# EAGLE design schemat sterownika (EAGLE 9.6.2)
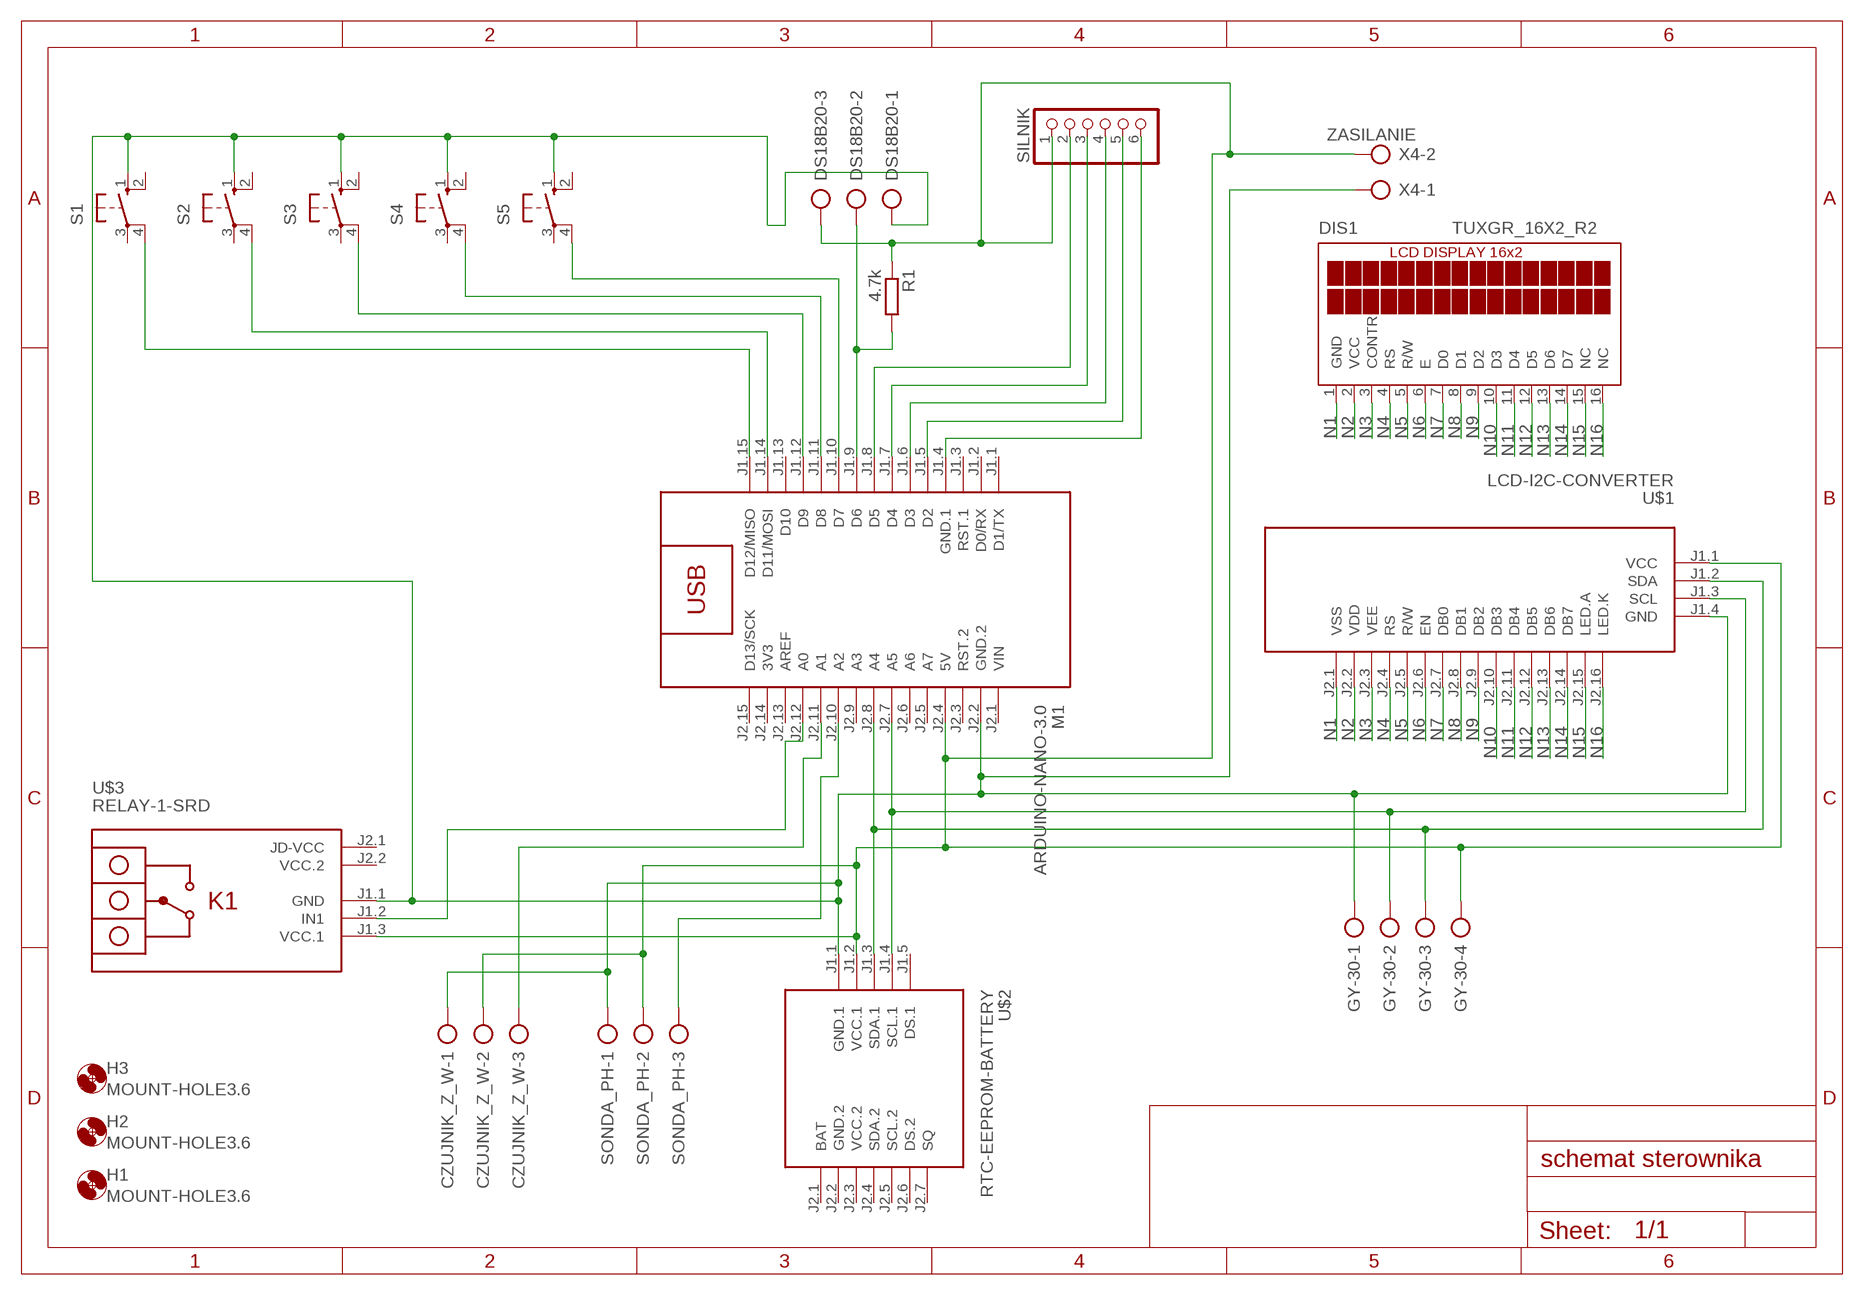
[diagram p0: schematic, sheet 1]

## Parts
CZUJNIK_Z_W  AK500/3  [AK500/3]
DIS1  TUXGR_16X2_R2  [TUXGR_16X2_R2]
DS18B20  AK500/3  [AK500/3]
GY-30  AK500/4  [AK500/4]
H1  MOUNT-HOLE3.6  [3,6]
H2  MOUNT-HOLE3.6  [3,6]
H3  MOUNT-HOLE3.6  [3,6]
M1  ARDUINO-NANO-3.0  [ARDUINO-NANO-3.0]
R1  4.7k  R-EU_0204/7  [0204/7]
S1  10-XX  [B3F-10XX]
S2  10-XX  [B3F-10XX]
S3  10-XX  [B3F-10XX]
S4  10-XX  [B3F-10XX]
S5  10-XX  [B3F-10XX]
SILNIK  PINHD-1X6  [1X06]
SONDA_PH  AK500/3  [AK500/3]
U$1  LCD-I2C-CONVERTER  [LCD-I2C-CONVERTER]
U$2  RTC-EEPROM-BATTERY  [RTC-EEPROM-BATTERY]
U$3  RELAY-1-SRD  [RELAY-1-SRD]
X4  ZASILANIE  AK500/2  [AK500/2]

## Nets
N1: DIS1.1(GND) U$1.J2.1(VSS)
N2: DIS1.2(VCC) U$1.J2.2(VDD)
N3: DIS1.3(CONTR) U$1.J2.3(VEE)
N4: DIS1.4(RS) U$1.J2.4(RS)
N5: DIS1.5(R/W) U$1.J2.5(R/W)
N6: DIS1.6(E) U$1.J2.6(EN)
N7: DIS1.7(D0) U$1.J2.7(DB0)
N8: DIS1.8(D1) U$1.J2.8(DB1)
N9: DIS1.9(D2) U$1.J2.9(DB2)
N10: DIS1.10(D3) U$1.J2.10(DB3)
N11: DIS1.11(D4) U$1.J2.11(DB4)
N12: DIS1.12(D5) U$1.J2.12(DB5)
N13: DIS1.13(D6) U$1.J2.13(DB6)
N14: DIS1.14(D7) U$1.J2.14(DB7)
N15: DIS1.15(NC) U$1.J2.15(LED.A)
N16: DIS1.16(NC) U$1.J2.16(LED.K)
N$1: CZUJNIK_Z_W.1 DS18B20.1 GY-30.1 M1.J2.2(GND.2) S1.1(S) S2.1(S) S3.1(S) S4.1(S) S5.1(S) SONDA_PH.1 U$1.J1.4(GND) U$2.J1.1(GND.1) U$3.J1.1(GND) X4.1
N$2: M1.J2.10(A2) SONDA_PH.3
N$3: CZUJNIK_Z_W.3 M1.J2.11(A1)
N$4: M1.J2.12(A0) U$3.J1.2(IN1)
N$5: DS18B20.2 M1.J1.9(D6) R1.2
N$6: M1.J1.8(D5) SILNIK.2
N$7: M1.J1.7(D4) SILNIK.3
N$8: M1.J1.6(D3) SILNIK.4
N$9: M1.J1.5(D2) SILNIK.5
N$10: M1.J1.4(GND.1) SILNIK.6
N$11: CZUJNIK_Z_W.2 DS18B20.3 GY-30.4 M1.J2.4(5V) R1.1 SILNIK.1 SONDA_PH.2 U$1.J1.1(VCC) U$2.J1.2(VCC.1) U$3.J1.3(VCC.1) X4.2
N$12: M1.J1.10(D7) S5.4(P1)
N$13: M1.J1.11(D8) S4.4(P1)
N$14: M1.J1.12(D9) S3.4(P1)
N$15: M1.J1.14(D11/MOSI) S2.4(P1)
N$16: M1.J1.15(D12/MISO) S1.4(P1)
N$18: GY-30.2 M1.J2.7(A5) U$1.J1.3(SCL) U$2.J1.4(SCL.1)
N$19: GY-30.3 M1.J2.8(A4) U$1.J1.2(SDA) U$2.J1.3(SDA.1)
Unconnected: M1.J1.1(D1/TX) M1.J1.2(D0/RX) M1.J1.3(RST.1) M1.J1.13(D10) M1.J2.3(RST.2) M1.J2.5(A7) M1.J2.6(A6) M1.J2.9(A3) M1.J2.13(AREF) M1.J2.15(D13/SCK) S1.2(S1) S1.3(P) S2.2(S1) S2.3(P) S3.2(S1) S3.3(P) S4.2(S1) S4.3(P) S5.2(S1) S5.3(P) U$2.J1.5(DS.1) U$2.J2.1(BAT) U$2.J2.4(SDA.2) U$2.J2.5(SCL.2) U$2.J2.6(DS.2) U$2.J2.7(SQ) U$3.J2.1(JD-VCC)

## Power pins joined to a net without a drawn wire
3V3: M1.J2.14(3V3)
GND.2: U$2.J2.2(GND.2)
VCC.2: U$2.J2.3(VCC.2) U$3.J2.2(VCC.2)
VIN: M1.J2.1(VIN)

## Library data of the parts
CZUJNIK_Z_W DS18B20 SONDA_PH = con-ptr500:AK500/3: CONNECTOR; OC_FARNELL: unknown; OC_NEWARK: unknown
DIS1 = display-lcd:TUXGR_16X2_R2: Tuxgraphics LCD display 16x2 characters reflective, without background light Source: tuxgr_12x2_r2.pdf; OC_FARNELL: unknown; OC_NEWARK: unknown
GY-30 = con-ptr500:AK500/4: CONNECTOR; OC_FARNELL: unknown; OC_NEWARK: unknown
H1-H3 = holes:MOUNT-HOLE: MOUNTING HOLE with drill center marker
M1 = elementy_Arduino:ARDUINO-NANO-3.0: Arduino Nano 3.0 and compatible devices More details available here: https://www.arduino.cc/en/Main/ArduinoBoardNano Click here to find device on ebay.com <http://www.ebay.com/sch/arduino+nano>
R1 = rcl:R-EU_: RESISTOR, European symbol; SPICEPREFIX: R
S1-S5 = switch-omron:10-XX: OMRON SWITCH; MPN: B3F-1000; OC_FARNELL: 176432; OC_NEWARK: 36M3542
SILNIK = pinhead:PINHD-1X6: PIN HEADER
U$1 = elementy_Arduino:LCD-I2C-CONVERTER: I2C Bus to 4-Bit Parallel LCD Interface with LED backlight driver
U$2 = elementy_Arduino:RTC-EEPROM-BATTERY: RTC Module with Battery and EEPROM based on DS1307 and AT24C32 chips More details available here: http://henrysbench.capnfatz.com/henrys-bench/arduino-sensors-and-input/arduino-tiny-rtc-d1307-tutorial/ Click here to find device on ebay.com <http://www.ebay.com/sch/tiny+rtc+arduino>
U$3 = elementy_Arduino:RELAY-1-SRD: 1-Channel Relay Module based on SRD-05VDC-SL-C relays Click here to find device on ebay.com <http://www.ebay.com/sch/one+channel+isolated+relay+5v>
X4 = con-ptr500:AK500/2: CONNECTOR; OC_FARNELL: unknown; OC_NEWARK: unknown

## Board
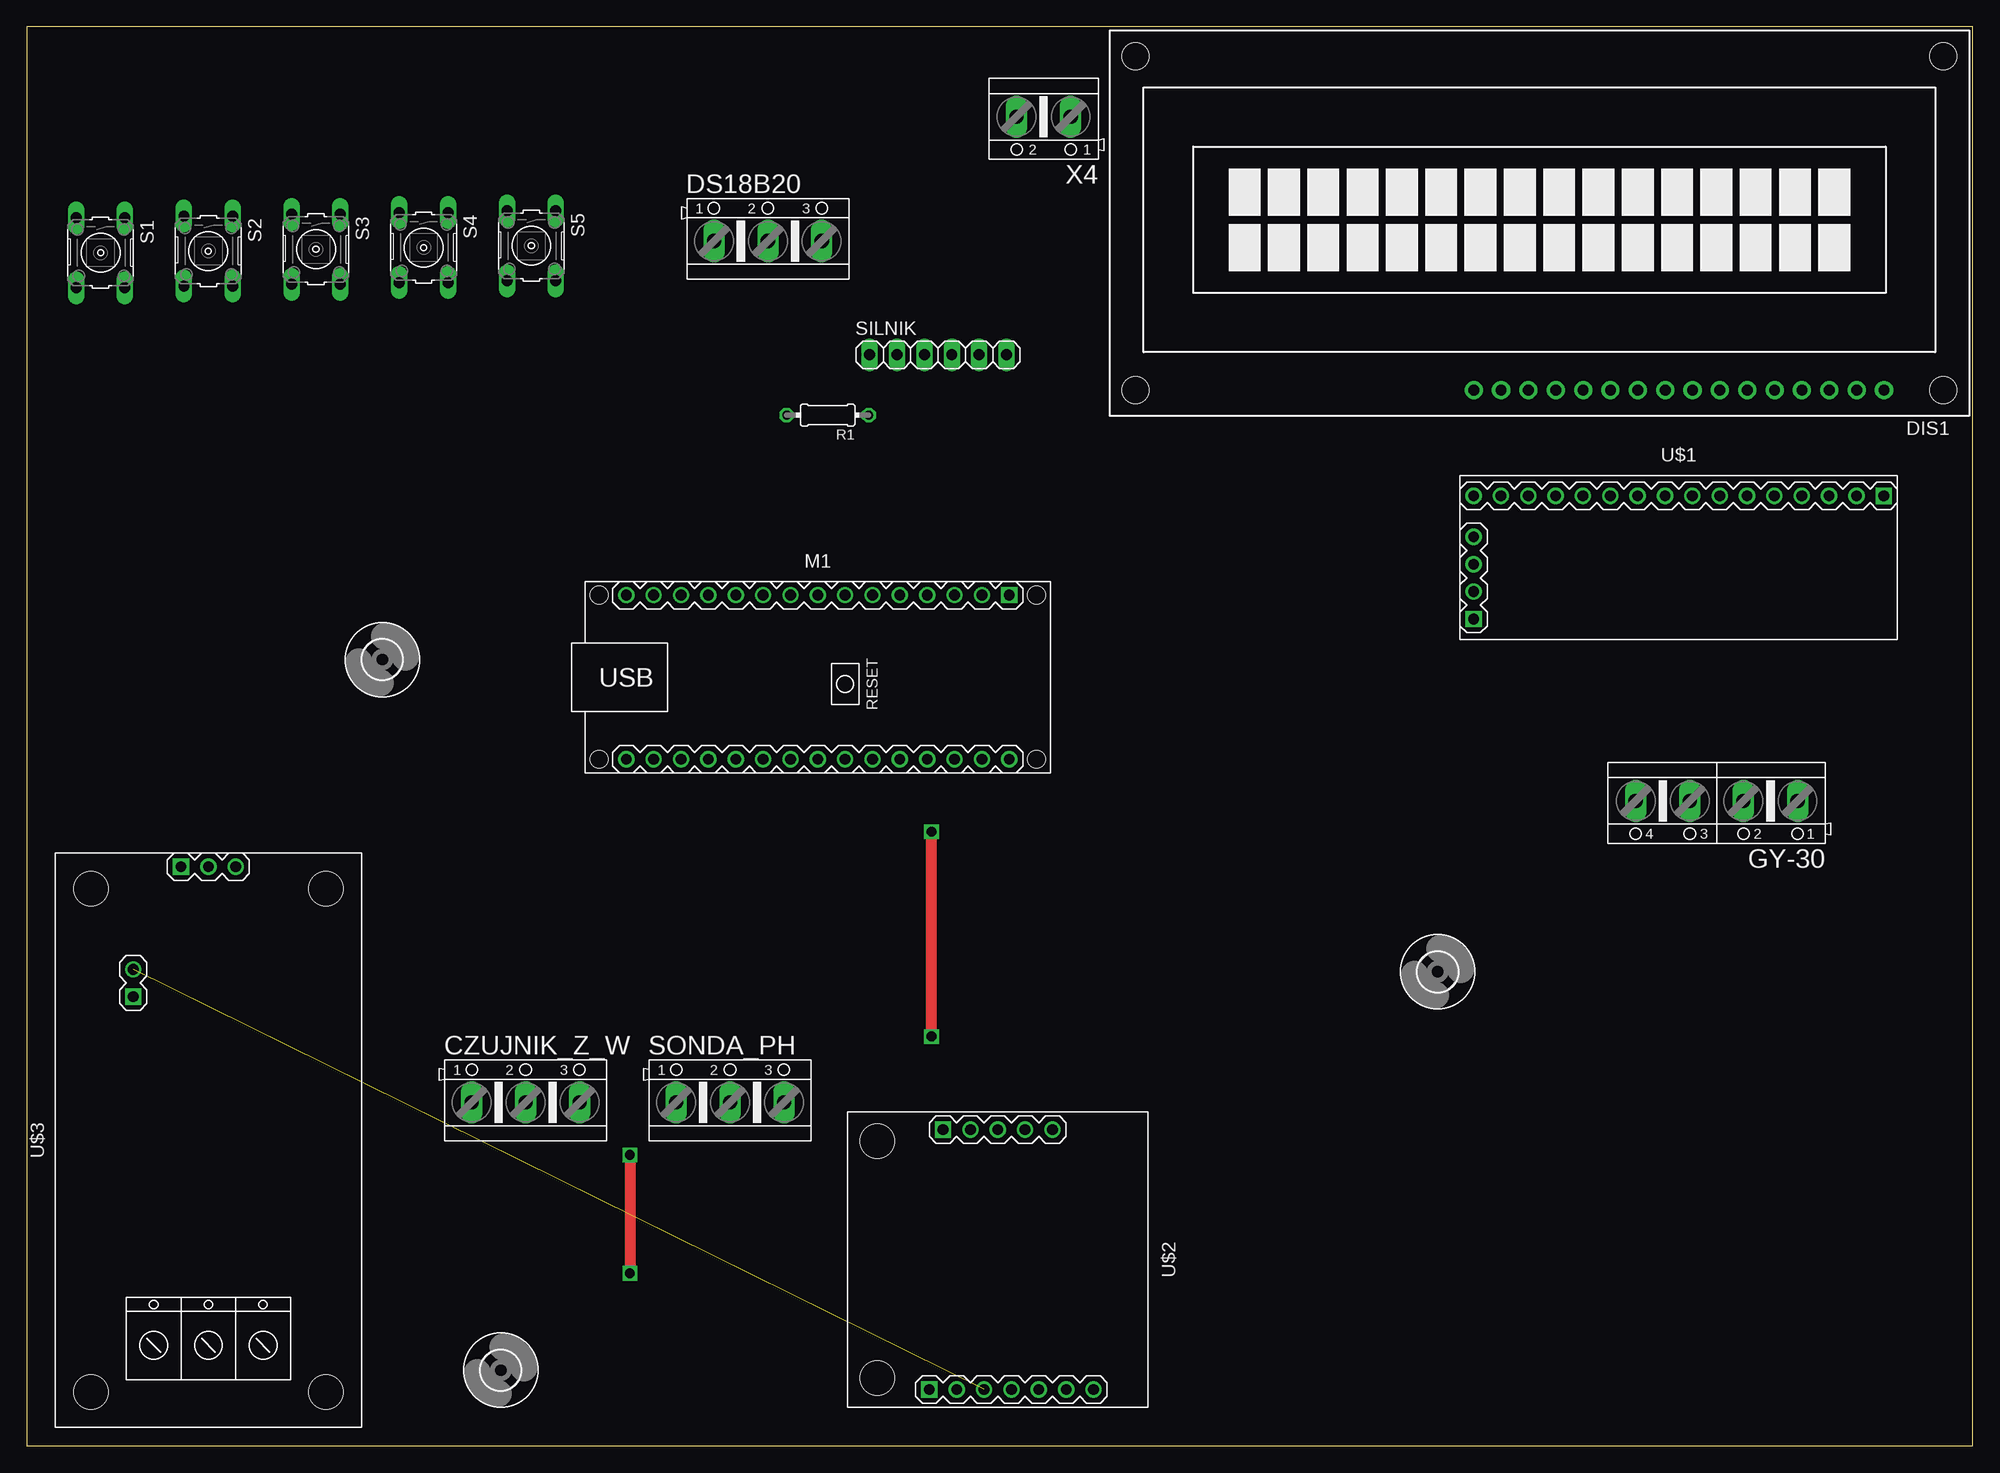
[diagram p1: board, top side]
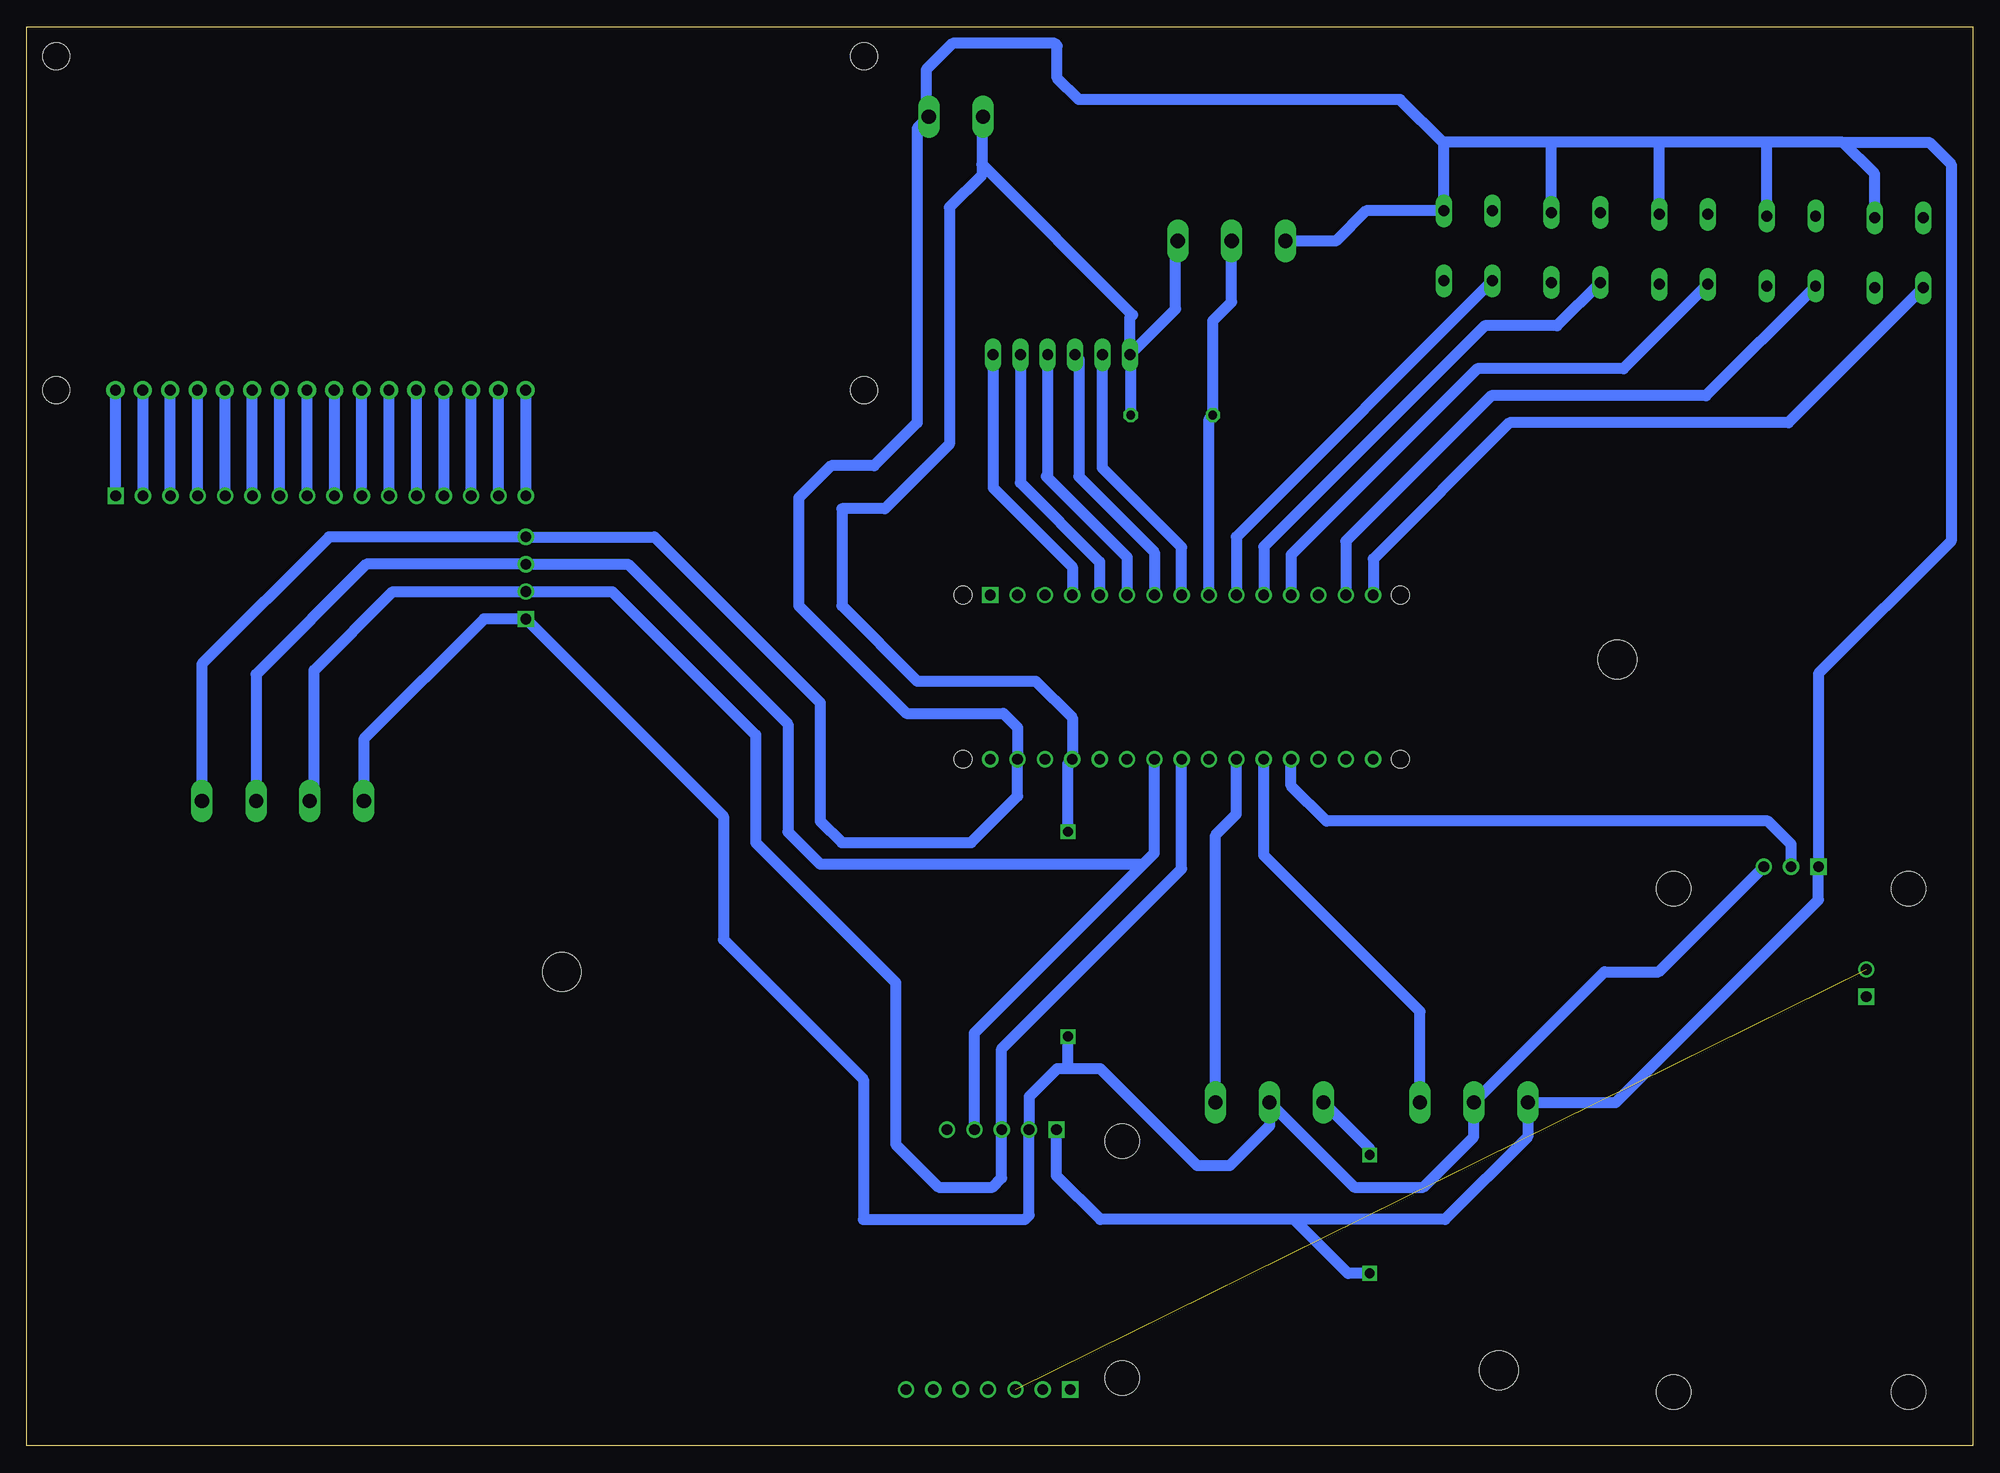
[diagram p2: board, bottom side, seen from below]

Size 180.67 x 131.75 mm. Coordinates in mm from the lower left corner, seen from the top.
Outline: 0,0 180.67,0 180.67,131.75 0,131.75 0,0
Copper layers (1*16): Top 0.035mm / dielectric 1.5mm / Bottom 0.035mm
Design rules "default": minimum track width 6mil, minimum drill 0.35mm, track to track 6mil, track to pad 6mil, pad to pad 6mil, via to via 6mil, smd to smd 6mil, copper to edge 40mil, drill to drill 6mil, minimum pad ring 10mil, minimum via ring 8mil, stop-mask expansion 4mil, vias tented up to drill 0mil, thermal gap 10mil

### Footprints (pad centres in the part's own frame; a part is rotated, then mirrored left to right if it is on the bottom)
AK500/3 = drill 1.321 long: 1 -5.004,0; 2 0,0; 3 5.004,0
TUXGR_16X2_R2 = drill 1 pad 1.676: 1 -32,15.5; 2 -29.46,15.5; 3 -26.92,15.5; 4 -24.38,15.5; 5 -21.84,15.5; 6 -19.3,15.5; 7 -16.76,15.5; 8 -14.22,15.5; 9 -11.68,15.5; 10 -9.14,15.5; 11 -6.6,15.5; 12 -4.06,15.5; 13 -1.52,15.5; 14 1.02,15.5; 15 3.56,15.5; 16 6.1,15.5 | hole 2.5: -37.5,-15.5; 37.5,-15.5; -37.5,15.5; 37.5,15.5
AK500/4 = drill 1.321 long: 1 -7.518,0; 2 -2.489,0; 3 2.489,0; 4 7.518,0
3,6 = hole 3.6: 0,0
ARDUINO-NANO-3.0 = drill 1 square: J1.1 17.78,7.62 | drill 1: J1.2 15.24,7.62; J1.3 12.7,7.62; J1.4 10.16,7.62; J1.5 7.62,7.62; J1.6 5.08,7.62; J1.7 2.54,7.62; J1.8 0,7.62; J1.9 -2.54,7.62; J1.10 -5.08,7.62; J1.11 -7.62,7.62; J1.12 -10.16,7.62; J1.13 -12.7,7.62; J1.14 -15.24,7.62; J1.15 -17.78,7.62; J2.1 17.78,-7.62; J2.2 15.24,-7.62; J2.3 12.7,-7.62; J2.4 10.16,-7.62; J2.5 7.62,-7.62; J2.6 5.08,-7.62; J2.7 2.54,-7.62; J2.8 0,-7.62; J2.9 -2.54,-7.62; J2.10 -5.08,-7.62; J2.11 -7.62,-7.62; J2.12 -10.16,-7.62; J2.13 -12.7,-7.62; J2.14 -15.24,-7.62; J2.15 -17.78,-7.62 | hole 1.651: -20.32,7.62; -20.32,-7.62; 20.32,-7.62; 20.32,7.62
0204/7 = drill 0.813 octagon: 1 -3.81,0; 2 3.81,0
B3F-10XX = drill 1.016 long: 1 -3.251,2.261; 2 3.251,2.261; 3 -3.251,-2.261; 4 3.251,-2.261
1X06 = drill 1.016 long: 1 -6.35,0; 2 -3.81,0; 3 -1.27,0; 4 1.27,0; 5 3.81,0; 6 6.35,0
LCD-I2C-CONVERTER = drill 1 square: J1.1 -19.05,-5.08; J2.1 19.05,6.35 | drill 1: J1.2 -19.05,-2.54; J1.3 -19.05,0; J1.4 -19.05,2.54; J2.2 16.51,6.35; J2.3 13.97,6.35; J2.4 11.43,6.35; J2.5 8.89,6.35; J2.6 6.35,6.35; J2.7 3.81,6.35; J2.8 1.27,6.35; J2.9 -1.27,6.35; J2.10 -3.81,6.35; J2.11 -6.35,6.35; J2.12 -8.89,6.35; J2.13 -11.43,6.35; J2.14 -13.97,6.35; J2.15 -16.51,6.35; J2.16 -19.05,6.35
RTC-EEPROM-BATTERY = drill 1 square: J1.1 -12.065,-5.08; J2.1 12.065,-6.35 | drill 1: J1.2 -12.065,-2.54; J1.3 -12.065,0; J1.4 -12.065,2.54; J1.5 -12.065,5.08; J2.2 12.065,-3.81; J2.3 12.065,-1.27; J2.4 12.065,1.27; J2.5 12.065,3.81; J2.6 12.065,6.35; J2.7 12.065,8.89 | hole 3.2: -11,-11.176; 11,-11.176
RELAY-1-SRD = drill 1 square: J1.1 25.4,2.54; J2.1 13.335,6.985 | drill 1: J1.2 25.4,0; J1.3 25.4,-2.54; J2.2 15.875,6.985 | hole 3.2: -23.368,10.922; 23.368,10.922; 23.368,-10.922; -23.368,-10.922
AK500/2 = drill 1.321 long: 1 -2.515,0; 2 2.515,0

### Placement (x,y rotation side)
CZUJNIK_Z_W  46.31,31.87 0 top
DIS1  140.45,113.53 180 top
DS18B20  68.8,111.87 0 top
GY-30  156.9,59.87 180 top
H1  131,44 0 top
H2  44,7 0 top
H3  33,73 0 top
M1  73.44,71.36 0 top
R1  74.36,95.7 180 top
S1  6.84,110.78 270 top
S2  16.84,110.94 270 top
S3  26.84,111.1 270 top
S4  36.84,111.26 270 top
S5  46.84,111.42 270 top
SILNIK  84.61,101.3 0 top
SONDA_PH  65.29,31.87 0 top
U$1  153.38,81.85 0 top
U$2  90.15,17.28 270 top
U$3  16.85,28.36 90 top
X4  94.41,123.41 180 top

### Tracks (layer width: path | path; a pad name or v marks a point on that pad's centre or on a via)
N1
  Bottom 1.016: U$1.J2.1 172.43,98.01 DIS1.1
N2
  Bottom 1.016: U$1.J2.2 169.89,98.01 DIS1.2
N3
  Bottom 1.016: U$1.J2.3 167.35,98.01 DIS1.3
N4
  Bottom 1.016: U$1.J2.4 164.81,98.01 DIS1.4
N5
  Bottom 1.016: U$1.J2.5 162.27,98.01 DIS1.5
N6
  Bottom 1.016: U$1.J2.6 159.73,98.01 DIS1.6
N7
  Bottom 1.016: U$1.J2.7 157.19,98.01 DIS1.7
N8
  Bottom 1.016: U$1.J2.8 154.65,98.01 DIS1.8
N9
  Bottom 1.016: U$1.J2.9 152.11,98.01 DIS1.9
N10
  Bottom 1.016: U$1.J2.10 149.57,98.01 DIS1.10
N11
  Bottom 1.016: U$1.J2.11 147.03,98.01 DIS1.11
N12
  Bottom 1.016: U$1.J2.12 144.49,98.01 DIS1.12
N13
  Bottom 1.016: U$1.J2.13 141.95,98.01 DIS1.13
N14
  Bottom 1.016: U$1.J2.14 139.41,98.01 DIS1.14
N15
  Bottom 1.016: U$1.J2.15 136.87,98.01 DIS1.15
N16
  Bottom 1.016: U$1.J2.16 134.33,98.01 DIS1.16
N$1  (via drill 0.9)
  Top 1.016: v56,27 v56,16
  Bottom 1.016: GY-30.1 164.42,72.58 152.61,84.39 U$1.J1.4 122.39,84.39 107,69 107,58 105,56 93,56 88.68,60.32 M1.J2.2 88.68,66.68 90,68 99,68 109,78 109,88 106,91 102,91 98,95 98,122.33 97.17,123.17 | X4.1 97.17,123.17 | S1.1 9.1,118.1 12.03,121.03 | 12.03,121.03 19,121.03 | 19,121.03 29,121.03 | 29,121.03 39,121.03 | 39,121.03 49,121.03 49.1,120.93 | S2.1 19.1,120.93 19,121.03 | S3.1 29.1,120.93 29,121.03 | S4.1 39.1,120.93 39,121.03 | 49.1,120.93 S5.1 56.33,114.67 59.13,111.87 DS18B20.1 | 12.03,121.03 4.03,121.03 2,119 2,84 14.31,71.69 U$3.J1.1 14.31,50.69 33.13,31.87 CZUJNIK_Z_W.1 41.31,28.69 49,21 63,21 | U$2.J1.1 85.07,25.07 81,21 63,21 | SONDA_PH.1 56,27.58 v56,27 | v56,16 58,16 63,21 | 49.1,120.93 53.17,125 83,125 85,127 85,130 85.23,130.23 94.7,130.23 97.17,127.76 97.17,123.17
N$2
  Bottom 1.016: SONDA_PH.3 70.29,56.71 68.36,58.64 M1.J2.10
N$3
  Bottom 1.016: CZUJNIK_Z_W.3 51.31,40.31 65.82,54.82 M1.J2.11
N$4
  Bottom 1.016: U$3.J1.2 16.85,55.85 19,58 60,58 63.28,61.28 M1.J2.12
N$5
  Bottom 1.016: M1.J1.9 70.9,95.35 R1.2 70.55,104.45 68.8,106.2 DS18B20.2
N$6
  Bottom 1.016: SILNIK.2 80.8,90.8 73.44,83.44 M1.J1.8
N$7
  Bottom 1.016: SILNIK.3 83,100.96 83,90 75.98,82.98 M1.J1.7
N$8
  Bottom 1.016: SILNIK.4 85.88,90.12 86,90 78.5,82.5 78.5,79 M1.J1.6
N$9
  Bottom 1.016: SILNIK.5 88.42,89.42 81.06,82.06 M1.J1.5
N$10
  Bottom 1.016: SILNIK.6 90.96,88.96 83.6,81.6 M1.J1.4
N$11  (via drill 0.9)
  Top 1.016: v84,38 v84,57
  Bottom 1.016: GY-30.4 149.38,65.62 138.23,76.77 U$1.J1.1 116,58.44 116,47 103,34 103,21 88,21 87.61,21.39 U$2.J1.2 87.61,32.39 85,35 84,35 | X4.2 92,123.31 92,119 | 92,119 92,118 95,115 95,93 101,87 105,87 105,78 98,71 87,71 83.6,67.6 M1.J2.4 84,63.34 v84,57 | R1.1 78.17,101.21 SILNIK.1 | SILNIK.1 78.26,104.74 78,105 92,119 | SILNIK.1 74,105.56 74,113 73.8,112.8 DS18B20.3 | U$3.J1.3 29.15,44 34.18,44 CZUJNIK_Z_W.2 46.31,28.69 51,24 57.42,24 SONDA_PH.2 65.29,29.71 69,26 72,26 81,35 84,35 | 84,35 v84,38
N$12
  Bottom 1.016: S5.4 68.36,84.39 M1.J1.10
N$13
  Bottom 1.016: S4.4 38.59,104 45.3,104 65.82,83.48 M1.J1.11
N$14
  Bottom 1.016: S3.4 32.43,100 46,100 63.28,82.72 M1.J1.12
N$15
  Bottom 1.016: S2.4 24.77,97.5 44.7,97.5 58.2,84 M1.J1.14
N$16
  Bottom 1.016: S1.4 17.11,95 43,95 55.66,82.34 M1.J1.15
N$18
  Bottom 1.016: GY-30.2 159.39,71.61 149.15,81.85 U$1.J1.3 124.85,81.85 110,67 110,57 107,54 77,54 | U$2.J1.4 92.69,38.31 77,54 | M1.J2.7 75.98,55.02 77,54
N$19
  Bottom 1.016: GY-30.3 154,60.28 154,72 146.69,79.31 U$1.J1.2 126.31,79.31 113,66 113,56 100,43 100,28 96,24 91,24 90.15,24.85 U$2.J1.3 90.15,36.85 73.44,53.56 M1.J2.8
VCC.2  (1 unrouted)